# Altium schematic sheet Template_6L.SchDoc
size A4; DocumentNumber: 11; SheetNumber: 11; SheetTotal: 12; RelSerie: X
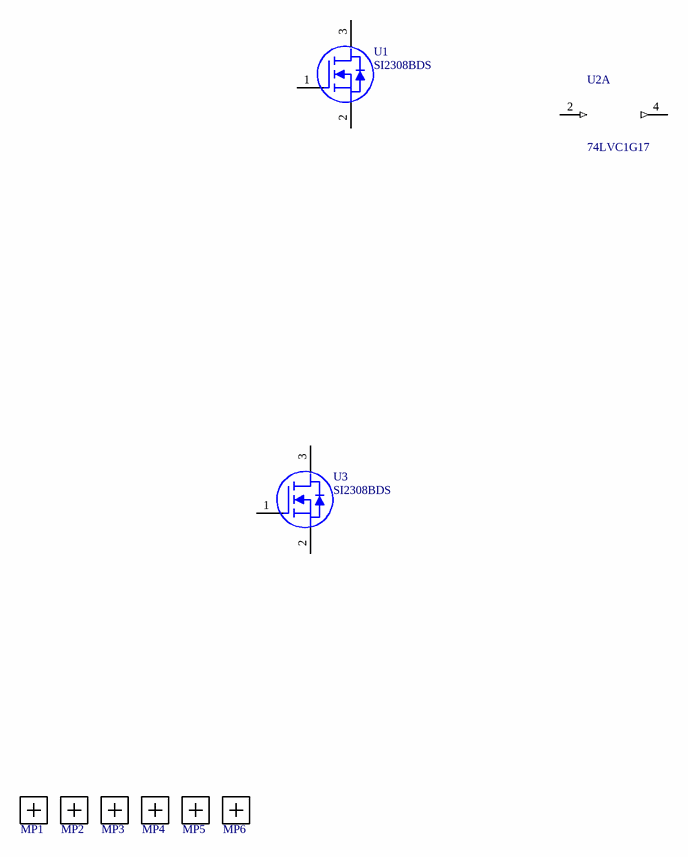
[diagram p0: Template_6L.SchDoc]

## Parts
MP1  Fiducial  [REF - smaller]  (value not drawn)  (no BOM)
MP2  Fiducial  [REF - smaller]  (value not drawn)  (no BOM)
MP3  Fiducial  [REF - smaller]  (value not drawn)  (no BOM)
MP4  Fiducial  [REF - smaller]  (value not drawn)  (no BOM)
MP5  Fiducial  [REF - smaller]  (value not drawn)  (no BOM)
MP6  Fiducial  [REF - smaller]  (value not drawn)  (no BOM)
U1  SI2308BDS  [SOT-23]
U2  74LVC1G17  [SOT353-1]  (part A of 2)
U3  SI2308BDS  [SOT-23]

## Nets

Not connected (* = marked no-connect by the designer): U1 1(G) 2(S) 3(D); U2 2(A) 4(Y); U3 1(G) 2(S) 3(D)

## Notes on the sheet
- safematic GmbH
- Bezeichnung:
- Printnummer:
- Filename:
- Elestastrasse 12
- CH-7310 Bad Ragaz
- www.safematic.ch <http://www.safematic.ch>
- Format:
- Blatt:
- Erstellt:
- Erst. Datum:
- Freigegeben:
- Serie
- Prototyp
- Entwicklung
- A4
- Nummer:
- Geprüft
- Geprüft Datum:
- Index:

## Library data of the parts
MP1-MP6 = MP_Fiducial
U1 U3 = T_SI2308BDS: Trans MOSFET N-CH 60V 1.9A 3-Pin SOT-23 T/R; Manufacturer 1: Vishay; Manufacturer Part Number 1: SI2308BDS-T1-GE3; Supplier 1: Digi-Key; Supplier Part Number 1: SI2308BDS-T1-GE3CT-ND; Case/Package: SOT-23; ComponentLink1URL: https://datasheet.ciiva.com/17068/0900766b80ed1e93-17068482.pdf; ComponentLink1Description: https://datasheet.ciiva.com/17068/0900766b80ed1e93-17068482.pdf; ComponentLink2URL: https://datasheet.ciiva.com/26139/si2308bd-26139136.pdf; ComponentLink2Description: https://datasheet.ciiva.com/26139/si2308bd-26139136.pdf; ComponentLink3URL: https://datasheet.ciiva.com/28603/1911751-28603483.pdf; ComponentLink3Description: https://datasheet.ciiva.com/28603/1911751-28603483.pdf; ComponentLink4URL: https://datasheet.ciiva.com/6388/si2308bd-6388236.pdf; ComponentLink4Description: https://datasheet.ciiva.com/6388/si2308bd-6388236.pdf; ComponentLink5URL: https://datasheet.ciiva.com/6388/si2308bd-6388237.pdf; ComponentLink5Description: https://datasheet.ciiva.com/6388/si2308bd-6388237.pdf; ComponentLink6URL: https://datasheet.ciiva.com/7643/si2308bd-7643237.pdf; ComponentLink6Description: https://datasheet.ciiva.com/7643/si2308bd-7643237.pdf; ComponentLink7URL: https://datasheet.ciiva.com/16221/si2308bd-16221719.pdf; ComponentLink7Description: https://datasheet.ciiva.com/16221/si2308bd-16221719.pdf; ComponentLink8URL: https://datasheet.ciiva.com/6388/si2308bd-6388235.pdf; ComponentLink8Description: https://datasheet.ciiva.com/6388/si2308bd-6388235.pdf
U2 = U_G_74LVC1G17: IC BUFFER SCHMITT TRIGGER 5TSOP; Manufacturer: NXP Semiconductors; Manufacturer Part Number: 74LVC2G17GW,125; ComponentLink1URL: https://datasheet.ciiva.com/17290/74lvc1g17-17290989.pdf; ComponentLink1Description: https://datasheet.ciiva.com/17290/74lvc1g17-17290989.pdf; ComponentLink2URL: https://datasheet.ciiva.com/6623/74lvc1g17-6623199.pdf; ComponentLink2Description: https://datasheet.ciiva.com/6623/74lvc1g17-6623199.pdf; ComponentLink3URL: https://datasheet.ciiva.com/1833/74lvc1g17-1833130.pdf; ComponentLink3Description: https://datasheet.ciiva.com/1833/74lvc1g17-1833130.pdf; ComponentLink4URL: https://datasheet.ciiva.com/1833/74lvc1g17-1833128.pdf; ComponentLink4Description: https://datasheet.ciiva.com/1833/74lvc1g17-1833128.pdf; ComponentLink5URL: https://datasheet.ciiva.com/1833/74lvc1g17-1833129.pdf; ComponentLink5Description: https://datasheet.ciiva.com/1833/74lvc1g17-1833129.pdf; Supplier 1: Digi-Key; Supplier Part Number 1: 1727-4218-1-ND; Case/Package: TSSOP; ComponentLink6URL: https://datasheet.ciiva.com/16463/74lvc2g17-16463432.pdf; ComponentLink6Description: https://datasheet.ciiva.com/16463/74lvc2g17-16463432.pdf; ComponentLink7URL: https://datasheet.ciiva.com/6623/74lvc2g17-6623158.pdf; ComponentLink7Description: https://datasheet.ciiva.com/6623/74lvc2g17-6623158.pdf; ComponentLink8URL: https://datasheet.ciiva.com/1832/74lvc2g17-1832730.pdf; ComponentLink8Description: https://datasheet.ciiva.com/1832/74lvc2g17-1832730.pdf; ComponentLink9URL: https://datasheet.ciiva.com/1832/74lvc2g17-1832731.pdf; ComponentLink9Description: https://datasheet.ciiva.com/1832/74lvc2g17-1832731.pdf; ComponentLink10URL: https://datasheet.ciiva.com/1832/74lvc2g17-1832732.pdf; ComponentLink10Description: https://datasheet.ciiva.com/1832/74lvc2g17-1832732.pdf; ComponentLink11URL: https://datasheet.ciiva.com/16199/74lvc2g17-16199742.pdf; ComponentLink11Description: https://datasheet.ciiva.com/16199/74lvc2g17-16199742.pdf